# Altium schematic sheet Power.SchDoc
size A4; SheetNumber: 2; SheetTotal: 2
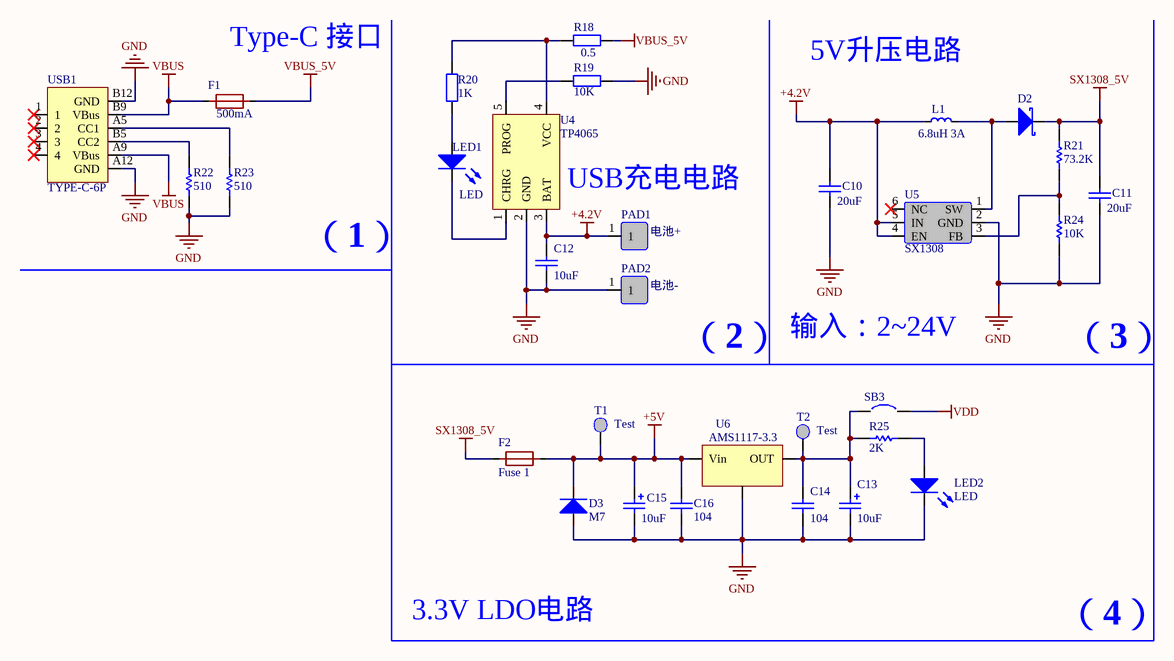
[diagram p0: Power.SchDoc]

## Parts
C10  value 20uF  [C1210]  (hidden comment: Cap)
C11  value 20uF  [C1210]  (hidden comment: Cap)
C12  value 10uF  [C0603]  (hidden comment: Cap)
C13  value 10uF  [CASE-A_3216]  (hidden comment: Cap Pol1)
C14  value 104  [C0603]  (hidden comment: Cap)
C15  value 10uF  [CASE-A_3216]  (hidden comment: Cap Pol1)
C16  value 104  [C0603]  (hidden comment: Cap)
D2  D Schottky  [SMA_L4.4-W2.8-LS5.4-RD]  (value not drawn)
D3  M7  [SOD-123_L2.8-W1.8-LS3.7-RD]
F1  500mA  [F0603]
F2  Fuse 1  [F0603]
L1  value 6.8uH 3A  [IND-SMD_L6.0-W6.0_SWPA6045S]  (hidden comment: Inductor)
LED1  LED  [LED0603_RED]
LED2  LED  [LED0603_RED]
PAD1  电池+  [PAD_1]
PAD2  电池-  [PAD_1]
R18  value 0.5  [R0805]  (hidden comment: Res_EU)
R19  value 10K  [R0603]  (hidden comment: Res_EU)
R20  value 1K  [R0603]  (hidden comment: Res_EU)
R21  value 73.2K  [R0603]  (hidden comment: Res)
R22  value 510  [R0603]  (hidden comment: Res)
R23  value 510  [R0603]  (hidden comment: Res)
R24  value 10K  [R0603]  (hidden comment: Res)
R25  value 2K  [R0603]  (hidden comment: Res)
SB3  Circuit Breaker  [JP2_SMD]  (value not drawn)
T1  Test  [TEST-SMD]
T2  Test  [TEST-SMD]
U4  TP4065  [SOT-23-5L]
U5  SX1308  [SOT-23-6_L2.9-W1.6-P0.95-LS2.8-BR]
U6  AMS1117-3.3  [SOT-223_L6.7-W3.5-P2.30-BR]
USB1  TYPE-C-6P  [USB-C-SMD_6P]

## Nets
+4.2V: C10.2 C12.2 L1.1 PAD1.1 U4.3(BAT) U5.4(EN) U5.5(IN)
+5V: C15.1 C16.2 D3.1(K) F2.2 T1.1(TEST) U6.3(Vin)
GND: C10.1 C11.1 C12.1 C13.2 C14.1 C15.2 C16.1 D3.2(A) LED2.2(K) PAD2.1 R19.1 R22.2 R23.2 R24.2 U4.2(GND) U5.2(GND) U6.1(GND) USB1.A12(GND) USB1.B12(GND)
SX1308_5V: C11.2 D2.2(K) F2.1 R21.1
VBUS: F1.1 USB1.A9(VBus) USB1.B9(VBus)
VBUS_5V: F1.2 R18.1
VDD: SB3.2
NetC13_1: C13.1 C14.2 R25.2 SB3.1 T2.1(TEST) U6.2(OUT)
NetD2_1: D2.1(A) L1.2 U5.1(SW)
NetLED1_1: LED1.1(A) R20.1
NetLED1_2: LED1.2(K) U4.1(CHRG)
NetLED2_1: LED2.1(A) R25.1
NetR18_2: R18.2 R20.2 U4.4(VCC)
NetR19_2: R19.2 U4.5(PROG)
NetR21_2: R21.2 R24.1 U5.3(FB)
NetR22_1: R22.1 USB1.B5(CC2)
NetR23_1: R23.1 USB1.A5(CC1)

Not connected (* = marked no-connect by the designer): U5 6(NC)*; USB1 1* 2* 3* 4*

## Notes on the sheet
- (near F1) Type-C 接口
- 5V升压电路
- (near U4) USB充电电路
- （1）
- （2）
- 输入：2~24V
- （3）
- 3.3V LDO电路
- （4）

## Library data of the parts
C10-C12 C14 C16 = Cap: 无极性电容; Publisher: 信念D力量
C13 C15 = Cap Pol1: 有极性电容; Published: 2020-7-27; Publisher: 信念D力量; LCSC_ID: C18104
D2 = D Schottky: 肖特基二极管; Published: 8-Jun-2000; LatestRevisionDate: 17-Jul-2002; LatestRevisionNote: Re-released for DXP Platform.; PackageReference: SMB; Publisher: Altium Limited; PackageDescription: DO-214-AA/SMB; 2 C-Bend Leads; Body 5.3 x 3.6 mm, inc. leads (LxW); Code_JEDEC: DO-214-AA
D3 = 1N4007: 1N4007 二极管
F1 F2 = Fuse 1: 保险丝 - Fuse
L1 = Inductor: 电感 - Inductor; Code_IEC: 1005; Published: 8-Jun-2000; LatestRevisionDate: 29-May-2009; LatestRevisionNote: IPC-7351 Footprint Added.; PackageReference: 0402-A; Publisher: Altium Limited; PackageDescription: Chip Inductor; Code_JEITA: 0402
LED1 LED2 = LED: 发光二极管
PAD1 PAD2 = PAD_1
R18-R20 = Res_EU: 欧盟电阻符号; Published: 8-Jun-2000; LatestRevisionDate: 17-Jul-2002
R21-R25 = Res: 美国电阻符号; Published: 8-Jun-2000; LatestRevisionDate: 29-May-2009; LatestRevisionNote: IPC-7351 Footprint Added.; PackageReference: J1-0603; Publisher: Altium Limited; PackageDescription: Chip Resistor
SB3 = Circuit Breaker: 断路器 短路选择 - Circuit Breaker; Solder: NO; Published: 24-Mar-1999; Revision: July-2002: Re-released for DXP Platform.; Publisher: Altium Limited
U4 = TP4065: 电池管理IC
U5 = SX1308: DC-DC电源芯片  DC-DC电源芯片 2V~24V
U6 = AMS1117-3.3: 线性稳压芯片 - Voltage Regulator
USB1 = TYPE-C-6P: Type-C USB，6P